# EAGLE design LoRa_RFM95_Shield (EAGLE 9.5.2)
CNAME: Arduino Uno LoRa Shield; CREVISION: 1.0.0
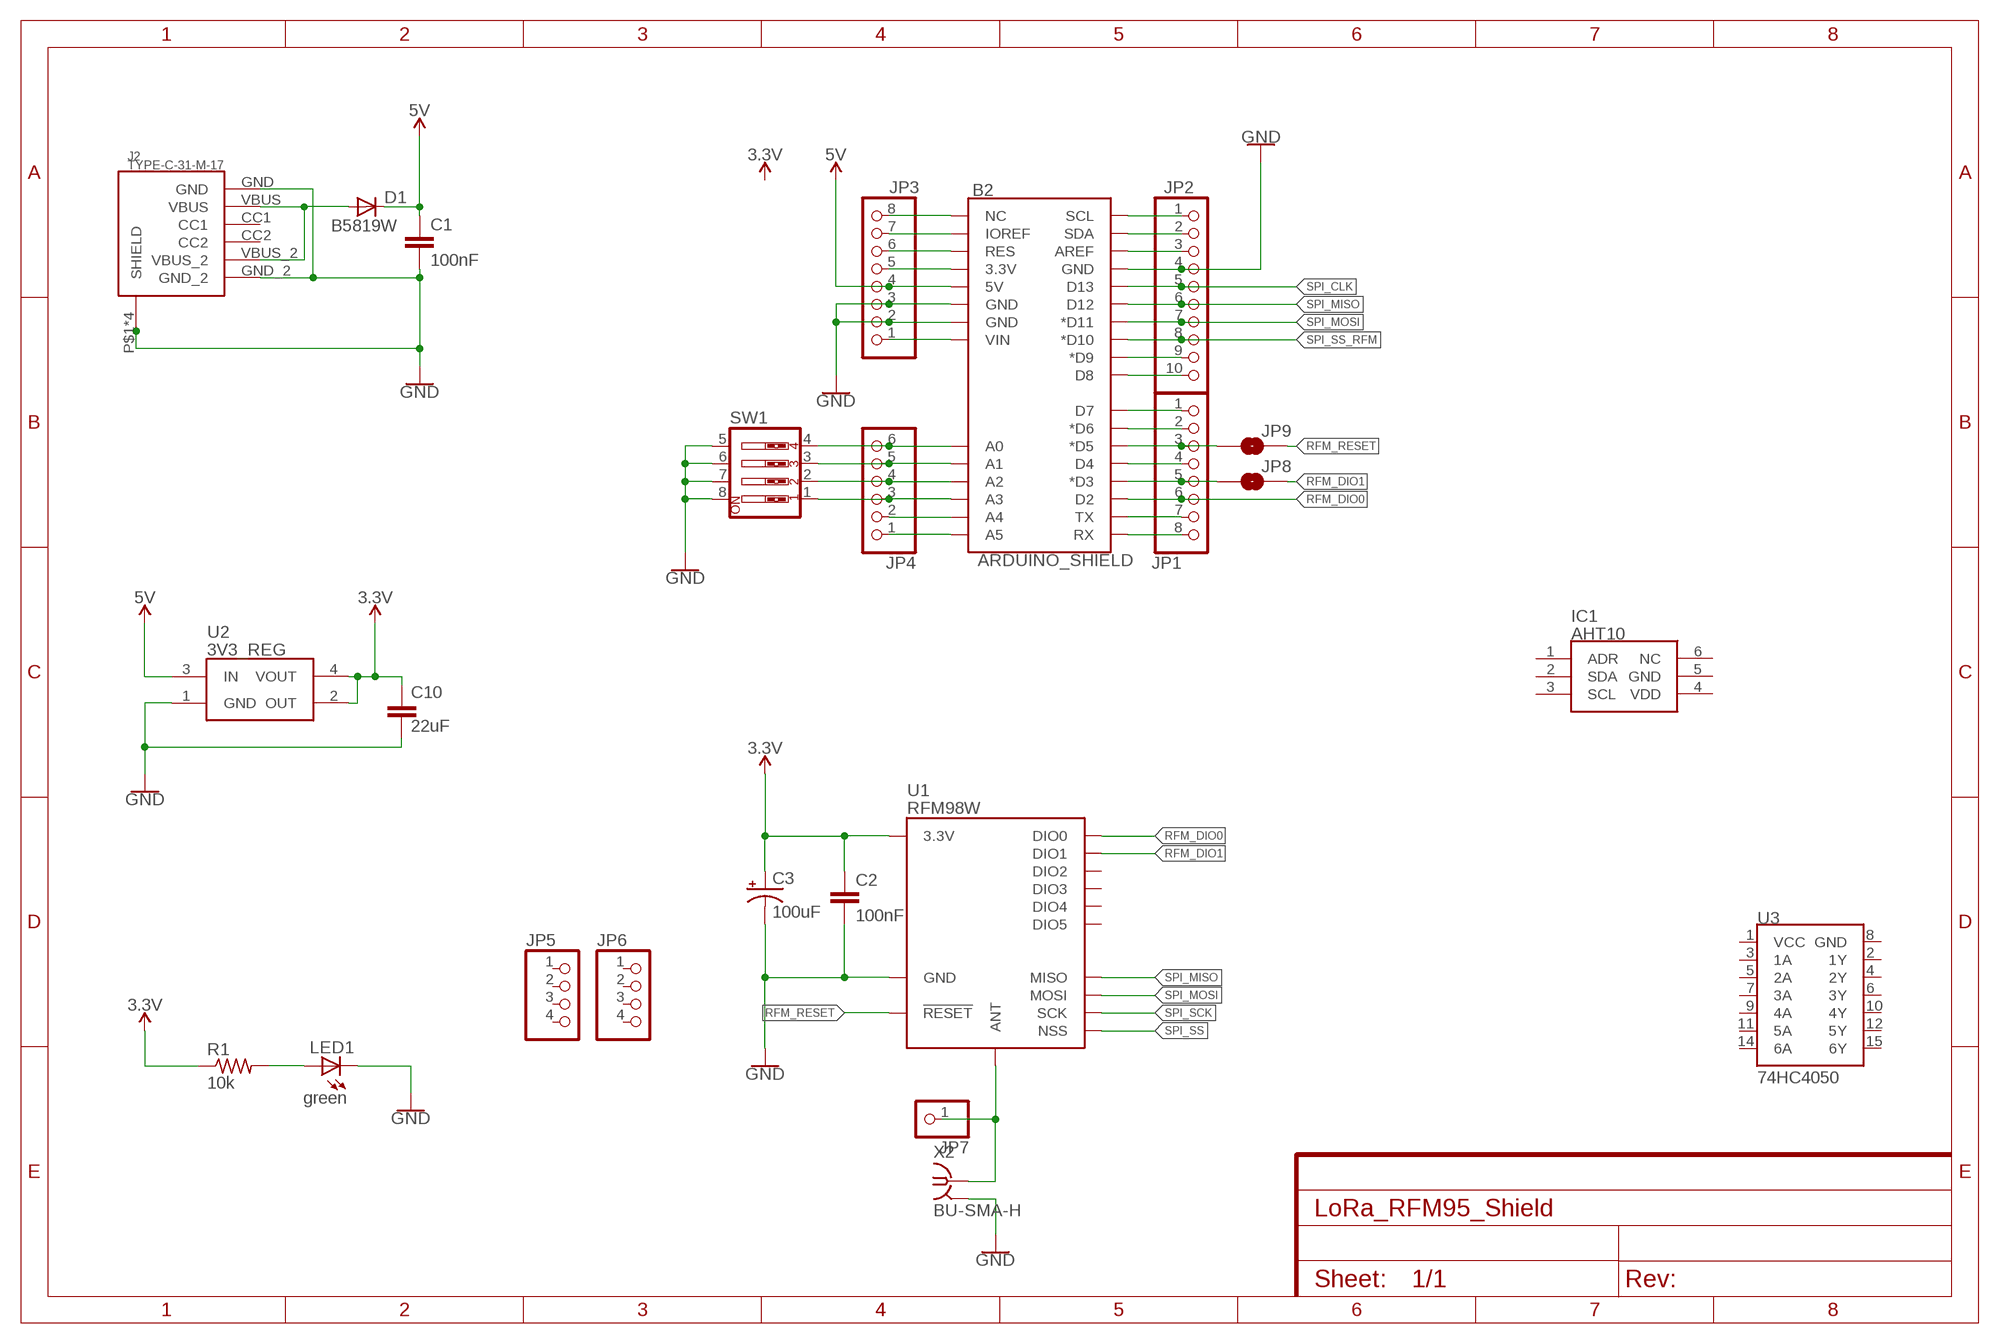
[diagram p0: schematic, sheet 1]

## Parts
B2  ARDUINO_SHIELD  ARDUINO_UNO_R3_SHIELDUNO_R3_SHIELD_NOLABELS_LOCK  [UNO_R3_SHIELD_NOLABELS_LOCK]
C1  100nF  C-EUC0603  [C0603]
C2  100nF  C-EUC0603  [C0603]
C3  100uF  CPOL-USSMCB  [SMC_B]
C10  22uF  C-EUC0805  [C0805]
D1  B5819W  DIODE-SOD-123  [SOD-123]
IC1  AHT10  [AHT10]
J2  TYPE-C-31-M-17  [TYPE-C-31-M-17]
JP1  PINHD-1X8/OCT  [1X08/OCT]
JP2  PINHD-1X10/OCT  [1X10/OCT]
JP3  PINHD-1X8/OCT  [1X08/OCT]
JP4  PINHD-1X6/OCT  [1X06/OCT]
JP5  PINHD-1X4/OCT  [1X04/OCT]
JP6  PINHD-1X4/OCT  [1X04/OCT]
JP7  PINHD-1X1/OCT  [1X01/OCT]
JP8  JUMPER-SMT_2_NO_SILK  [SMT-JUMPER_2_NO_SILK]
JP9  JUMPER-SMT_2_NO_SILK  [SMT-JUMPER_2_NO_SILK]
LED1  green  LEDCHIP-LED0603  [CHIP-LED0603]
R1  10k  R-US_R0603  [R0603]
SW1  SW_DIP-4  [EDG-04]
U1  RFM98W  RFM95W  [RFM95/96/97/98W]
U2  3V3_REG  AZ1117H-5.0TRE1  [SOT230P700X170-4N]
U3  74HC4050  HEX_CONVERTER  [SO16]
X2  BU-SMA-H  [BU-SMA-H]

## Nets
3.3V [power]: C2.1 C3.+ C10.2 R1.1 U1.3.3V U2.2(OUT) U2.4(VOUT)
5V [power]: B2.5V C1.1 D1.C JP3.4 U2.3(IN)
GND [power]: B2.GND@0(GND) B2.GND@1(GND) B2.GND@2(GND) C1.2 C2.2 C3.- C10.1 J2.GND J2.GND_2 J2.P$1(SHIELD) J2.P$2(SHIELD) J2.P$3(SHIELD) J2.P$4(SHIELD) JP2.4 JP3.2 JP3.3 LED1.C SW1.5 SW1.6 SW1.7 SW1.8 U1.GND@1(GND) U1.GND@2(GND) U1.GND@3(GND) U2.1(GND) X2.2 X2.3 X2.4 X2.5
N$1 [power]: D1.A J2.VBUS J2.VBUS_2
N$2 [RF]: JP7.1 U1.ANT X2.1
N$3: B2.SCL JP2.1
N$4: LED1.A R1.2
N$5: B2.SDA JP2.2
N$6: B2.AREF JP2.3
N$7: B2.VIN JP3.1
N$9: B2.D3(*D3) JP1.5 JP8.1
N$10: B2.D4 JP1.4
N$11: B2.D5(*D5) JP1.3 JP9.1
N$12: B2.D9(*D9) JP2.9
N$13: B2.D8 JP2.10
N$14: B2.D7 JP1.1
N$15: B2.D6(*D6) JP1.2
N$20: B2.TX JP1.7
N$21: B2.RX JP1.8
N$23: B2.3.3V JP3.5
N$24: B2.RES JP3.6
N$25: B2.IOREF JP3.7
N$26: B2.NC JP3.8
N$27: B2.A0 JP4.6 SW1.4
N$28: B2.A1 JP4.5 SW1.3
N$29: B2.A2 JP4.4 SW1.2
N$30: B2.A3 JP4.3 SW1.1
N$31: B2.A4 JP4.2
N$32: B2.A5 JP4.1
RFM_DIO0: B2.D2 JP1.6 U1.DIO0
RFM_DIO1: JP8.2 U1.DIO1
RFM_RESET: JP9.2 U1.!RESET
SPI_CLK: B2.D13 JP2.5
SPI_MISO: B2.D12 JP2.6 U1.MISO
SPI_MOSI: B2.D11(*D11) JP2.7 U1.MOSI
SPI_SCK [RF]: U1.SCK
SPI_SS: U1.NSS
SPI_SS_RFM: B2.D10(*D10) JP2.8
Unconnected: IC1.1(ADR) IC1.2(SDA) IC1.3(SCL) IC1.4(VDD) IC1.5(GND) IC1.6(NC) J2.CC1 J2.CC2 JP5.1 JP5.2 JP5.3 JP5.4 JP6.1 JP6.2 JP6.3 JP6.4 U1.DIO2 U1.DIO3 U1.DIO4 U1.DIO5 U3.1(VCC) U3.2(1Y) U3.3(1A) U3.4(2Y) U3.5(2A) U3.6(3Y) U3.7(3A) U3.8(GND) U3.9(4A) U3.10(4Y) U3.11(5A) U3.12(5Y) U3.14(6A) U3.15(6Y)

## Library data of the parts
B2 = angrypig7_Library:ARDUINO_UNO_R3_SHIELD: Arduino R3 Shield Footprint Shield form compatible with the Arduino Uno R3. SparkFun Products: MG2639 Cellular Shield <https://www.sparkfun.com/products/13120> MIDI Shield <https://www.sparkfun.com/products/12898> R3 Stackable Headers Kit <https://www.sparkfun.com/products/11417>
C1 C2 C10 = rcl:C-EU: CAPACITOR, European symbol; SPICEPREFIX: C
C3 = rcl:CPOL-US: POLARIZED CAPACITOR, American symbol; SPICEPREFIX: C
D1 = dp_devices:DIODE: Various Diode Packages
IC1 = SamacSys_Parts:AHT10: AHT10 Integrated temperature and humidity sensor Source: Datasheet <https://datasheet.lcsc.com/szlcsc/1901291508_Aosong-Guangzhou-Elec-AHT10_C368909.pdf>; DESCRIPTION: AHT10 Integrated temperature and humidity sensor; HEIGHT: 1.7mm; MANUFACTURER_NAME: Aosong (Guangzhou) Elec; MANUFACTURER_PART_NUMBER: AHT10
J2 = angrypig7_Library:TYPE-C-31-M-17
JP1 JP3 = pinhead_v2:PINHD-1X8: PIN HEADER
JP2 = pinhead_v2:PINHD-1X10: PIN HEADER
JP4 = pinhead_v2:PINHD-1X6: PIN HEADER
JP5 JP6 = pinhead_v2:PINHD-1X4: PIN HEADER
JP7 = pinhead_v2:PINHD-1X1: PIN HEADER
JP8 JP9 = SparkFun-Jumpers:JUMPER-SMT_2_NO: Normally open jumper This jumper has two pads in close proximity to each other. Apply solder to close the connection. Round pads are easier to solder for beginners, but are a lot larger. SparkFun Product that uses the round pads: SparkFun EL Sequencer <https://www.sparkfun.com/products/12781>
LED1 = adafruit:LED: LED OSRAM: - CHIPLED LG R971, LG N971, LY N971, LG Q971, LY Q971, LO R971, LY R971 LH N974, LH R974 LS Q976, LO Q976, LY Q976 LO Q996 - Hyper CHIPLED LW Q18S LB Q993, LB Q99A, LB R99A - SideLED LS A670, LO A670, LY A670, LG A670, LP A670 LB A673, LV A673, LT A673, LW A673 LH A674 LY A675 LS A676, LA A676, LO A676, LY A676, LW A676 LS A679, LY A679, LG A679 - Hyper Micro SIDELED® LS Y876, LA Y876, LO Y876, LY Y876 LT Y87S - SmartLED LW L88C, LW L88S LB L89C, LB L89S, LG L890 LS L89K, LO L89K, LY L89K LS L896, LA L896, LO L896, LY L896 - TOPLED LS T670, LO T670, LY T670, LG T670, LP T670 LSG T670, LSP T670, LSY T670, LOP T670, LYG T670 LG T671, LOG T671, LSG T671 LB T673, LV T673, LT T673, LW T673 LH T674 LS T676, LA T676, LO T676, LY T676, LB T676, LH T676, LSB T676, LW T676 LB T67C, LV T67C, LT T67C, LS T67K, LO T67K, LY T67K, LW E67C LS E67B, LA E67B, LO E67B, LY E67B, LB E67C, LV E67C, LT E67C LW T67C LS T679, LY T679, LG T679 LS T770, LO T770, LY T770, LG T770, LP T770 LB T773, LV T773, LT T773, LW T773 LH T774 LS E675, LA E675, LY E675, LS T675 LS T776, LA T776, LO T776, LY T776, LB T776 LHGB T686 LT T68C, LB T68C - Hyper Mini TOPLED® LB M676 - Mini TOPLED Santana® LG M470 LS M47K, LO M47K, LY M47K Source: http://www.osram.convergy.de/
R1 = rcl:R-US_: RESISTOR, American symbol; SPICEPREFIX: R
SW1 = special:SW_DIP-4: DIP SWITCH
U1 = SparkFun-RF:RFM95W: RFM95/96/97/98 The RFM95/96/97/98(W) transceivers feature the LoRaTM long range modem that provides ultra-long range spread spectrum communication and high interference immunity whilst minimising current consumption. These devices also support high performance (G)FSK modes for systems including WMBus, IEEE802.15.4g. The RFM95/96/97/98(W) deliver exceptional phase noise, selectivity, receiver linearity and IIP3 for significantly lower current consumption than competing devices Datasheet <http://www.hoperf.com/upload/rf/RFM95_96_97_98W.pdf>; PROD_ID: IC-13959
U2 = SamacSys_Parts:AZ1117H-5.0TRE1: 1A 5V LDO Linear Voltage Reg SOT-223 Diodes Inc AZ1117H-5.0TRE1, Single Linear Voltage Regulator, 1A 4.9 5.1 V, 1%, 3-Pin SOT-223 Source: Datasheet <https://componentsearchengine.com/Datasheets/1/AZ1117H-5.0TRE1.pdf>; DESCRIPTION: 1A 5V LDO Linear Voltage Reg SOT-223 Diodes Inc AZ1117H-5.0TRE1, Single Linear Voltage Regulator, 1A 4.9 5.1 V, 1%, 3-Pin SOT-223; HEIGHT: 1.7mm; MANUFACTURER_NAME: Diodes Inc.; MANUFACTURER_PART_NUMBER: AZ1117H-5.0TRE1; MOUSER_PART_NUMBER: 621-AZ1117H-5.0TRE1; MOUSER_PRICE-STOCK: https://www.mouser.com/Search/Refine.aspx?Keyword=621-AZ1117H-5.0TRE1
U3 = SparkFun-IC-Comms:HEX_CONVERTER: 74HC4050 Hex Buffer 74HC4050 Hex Buffer Level Shifter SMD SO016 SparkFun Products CAN-BUS Shield <https://www.sparkfun.com/products/13262> (DEV-13262) SparkFun MP3 Player Shield <https://www.sparkfun.com/products/12660> (DEV-12660) SparkFun microSD Shield <https://www.sparkfun.com/products/12761> (DEV-12761) SparkFun USB Host Shield <https://www.sparkfun.com/products/9947> (DEV-09947); PROD_ID: IC-09604
X2 = con-coax:BU-SMA-H: FEMALE SMA CONNECTOR Radiall; OC_FARNELL: unknown; OC_NEWARK: unknown

## Net classes
0 default: width 0.203 mm
1 power: width 0.508 mm
2 RF: width 1.524 mm

## Board
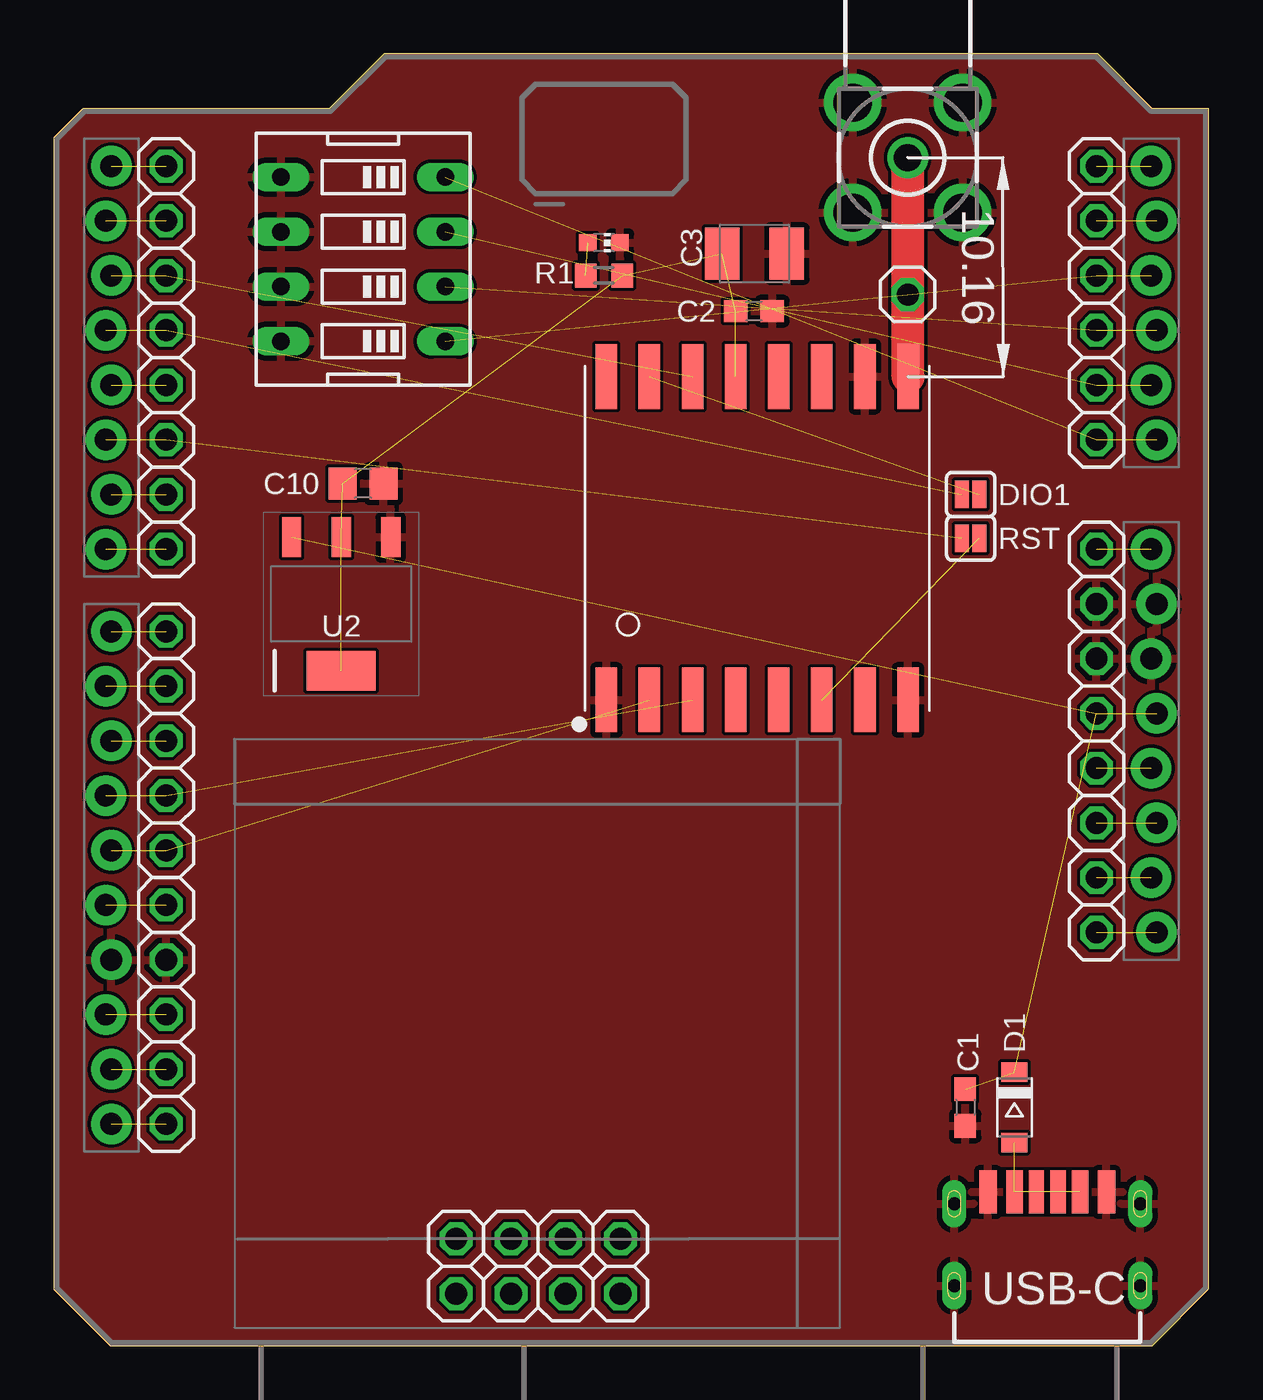
[diagram p1: board, top side]
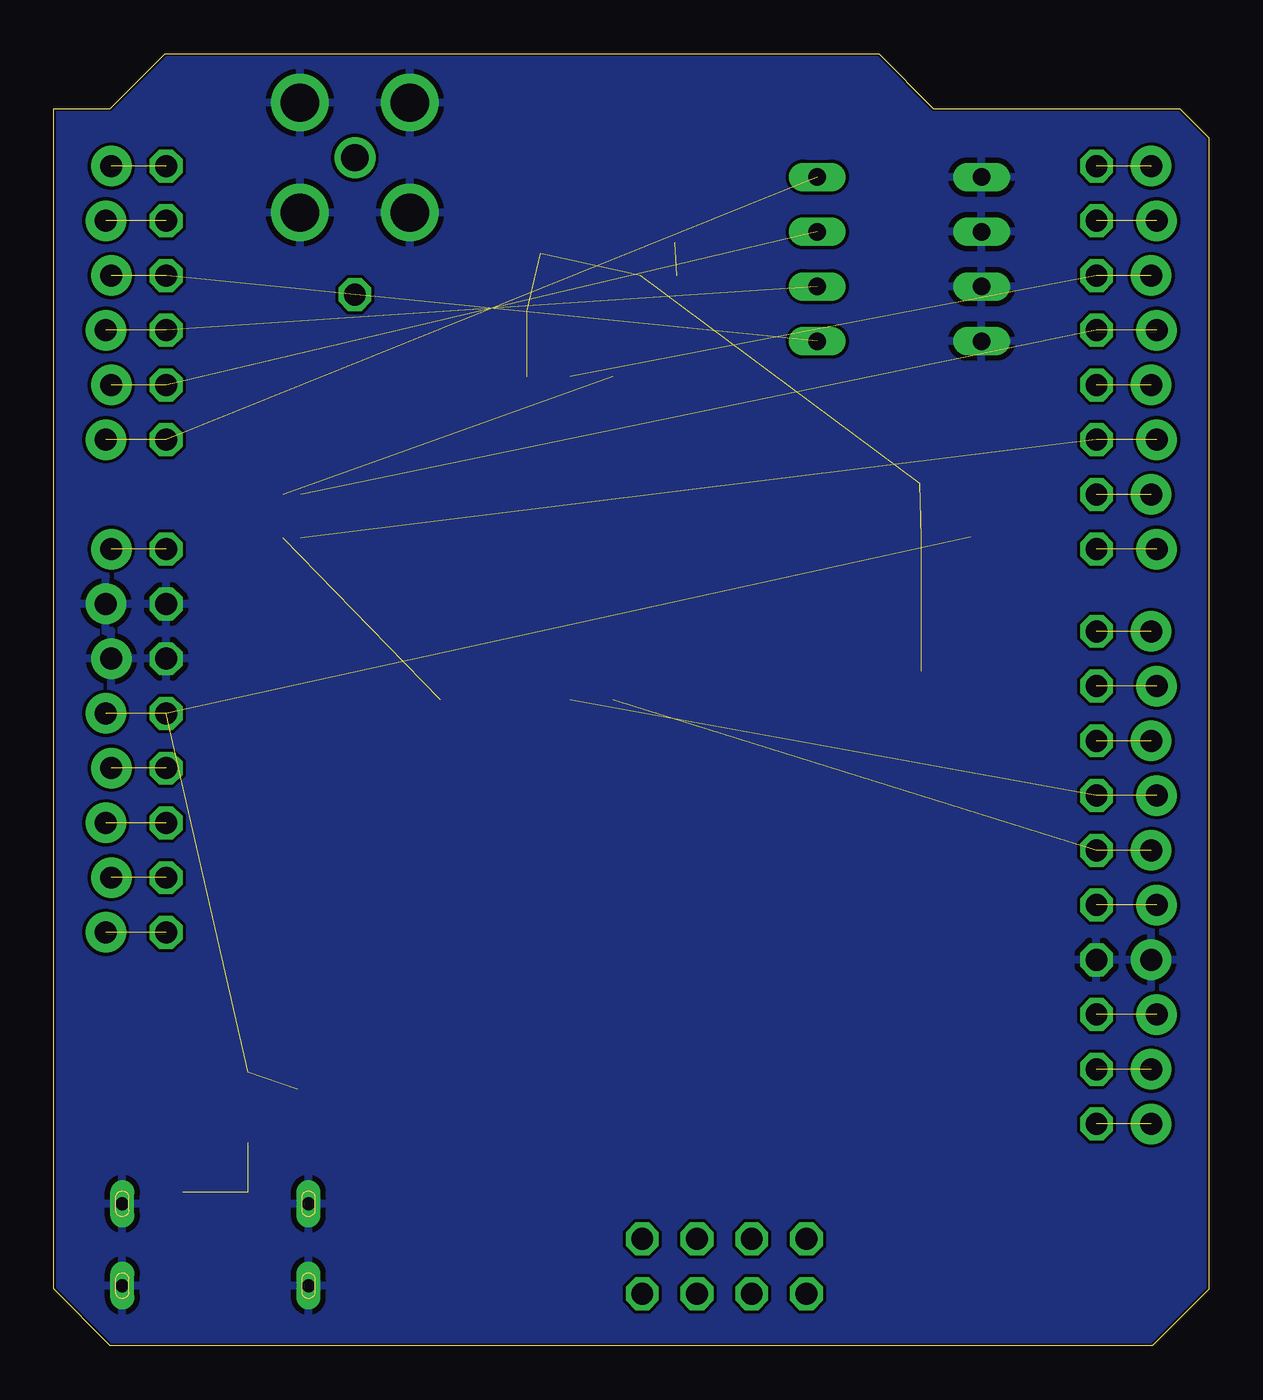
[diagram p2: board, bottom side, seen from below]

Size 53.59 x 59.94 mm. Coordinates in mm from the lower left corner, seen from the top.
Outline: 0,56.06 0,2.62 2.62,0 50.98,0 53.59,2.64 53.59,57.4 50.98,57.4 48.44,59.94 15.32,59.94 12.78,57.4 1.35,57.4 0,56.06
Copper layers (1*16): Top 0.035mm / dielectric 1.5mm / Bottom 0.035mm
Design rules "default *": minimum track width 6mil, minimum drill 0.35mm, track to track 6mil, track to pad 6mil, pad to pad 6mil, via to via 6mil, smd to smd 6mil, copper to edge 4mil, drill to drill 6mil, minimum pad ring 10mil, minimum via ring 8mil, stop-mask expansion 4mil, vias tented up to drill 0mil, thermal gap 10mil

### Footprints (pad centres in the part's own frame; a part is rotated, then mirrored left to right if it is on the bottom)
UNO_R3_SHIELD_NOLABELS_LOCK = drill 1.016 pad 1.88: 3.3V 24.13,-3.81; 5V 24.384,-1.27; A0 24.384,11.43; A1 24.13,13.97; A2 24.384,16.51; A3 24.13,19.05; A4 24.384,21.59; A5 24.13,24.13; AREF -24.384,-15.24; D2 -24.13,19.05; D3 -24.384,16.51; D4 -24.13,13.97; D5 -24.384,11.43; D6 -24.13,8.89; D7 -24.384,6.35; D8 -24.13,2.54; D9 -24.384,0; D10 -24.13,-2.54; D11 -24.384,-5.08; D12 -24.13,-7.62; D13 -24.384,-10.16; GND@0 24.13,1.27; GND@1 24.384,3.81; GND@2 -24.13,-12.7; IOREF 24.13,-8.89; NC 24.384,-11.43; RES 24.384,-6.35; RX -24.13,24.13; SCL -24.13,-20.32; SDA -24.13,-17.78; TX -24.384,21.59; VIN 24.13,6.35
C0603 = smd 1.1 x 1: 1 -0.85,0; 2 0.85,0
SMC_B = smd 1.6 x 2.4: + -1.5,0; - 1.5,0
C0805 = smd 1.3 x 1.5: 1 -0.95,0; 2 0.95,0
SOD-123 = smd 0.91 x 1.22: A 1.635,0; C -1.635,0
AHT10 = smd 1.27 x 1: 1 -1.6,1.27; 2 -1.6,0; 3 -1.6,-1.27; 4 1.6,-1.27; 5 1.6,0; 6 1.6,1.27
TYPE-C-31-M-17 = smd 0.7 x 2: CC1 -0.5,0.4; CC2 0.5,0.4 | smd 0.8 x 2: GND -2.75,0.4; GND_2 2.75,0.4 | drill 0.6 pad 1.1 long: P$1 4.32,-3.95; P$2 4.32,-0.15; P$3 -4.32,-0.15; P$4 -4.32,-3.95 | smd 0.76 x 2: VBUS -1.52,0.4; VBUS_2 1.52,0.4
1X08/OCT = drill 1.016 octagon: 1 -8.89,0; 2 -6.35,0; 3 -3.81,0; 4 -1.27,0; 5 1.27,0; 6 3.81,0; 7 6.35,0; 8 8.89,0
1X10/OCT = drill 1.016 octagon: 1 -11.43,0; 2 -8.89,0; 3 -6.35,0; 4 -3.81,0; 5 -1.27,0; 6 1.27,0; 7 3.81,0; 8 6.35,0; 9 8.89,0; 10 11.43,0
1X06/OCT = drill 1.016 octagon: 1 -6.35,0; 2 -3.81,0; 3 -1.27,0; 4 1.27,0; 5 3.81,0; 6 6.35,0
1X04/OCT = drill 1.016 octagon: 1 -3.81,0; 2 -1.27,0; 3 1.27,0; 4 3.81,0
1X01/OCT = drill 1.016 octagon: 1 0,0
SMT-JUMPER_2_NO_SILK = smd 0.635 x 1.27: 1 -0.406,0; 2 0.406,0
CHIP-LED0603 = smd 0.8 x 0.8: A 0,-0.75; C 0,0.75
R0603 = smd 1 x 1.1: 1 -0.85,0; 2 0.85,0
EDG-04 = drill 0.813 long: 1 -3.81,-3.81; 2 -1.27,-3.81; 3 1.27,-3.81; 4 3.81,-3.81; 5 3.81,3.81; 6 1.27,3.81; 7 -1.27,3.81; 8 -3.81,3.81
RFM95/96/97/98W = smd 3 x 1: 3.3V 7.5,1; !RESET -7.5,-3; ANT 7.5,-7; DIO0 7.5,3; DIO1 7.5,5; DIO2 7.5,7; DIO3 7.5,-3; DIO4 7.5,-1; DIO5 -7.5,-5; GND@1 -7.5,7; GND@2 -7.5,-7; GND@3 7.5,-5; MISO -7.5,5; MOSI -7.5,3; NSS -7.5,-1; SCK -7.5,1
SOT230P700X170-4N = smd 1.85 x 0.9: 1 3.1,-2.3; 2 3.1,0; 3 3.1,2.3 | smd 1.85 x 3.2: 4 -3.1,0
SO16 = smd 0.6 x 1.2: 1 -4.445,-2.8; 2 -3.175,-2.8; 3 -1.905,-2.8; 4 -0.635,-2.8; 5 0.635,-2.8; 6 1.905,-2.8; 7 3.175,-2.8; 8 4.445,-2.8; 9 4.445,2.8; 10 3.175,2.8; 11 1.905,2.8; 12 0.635,2.8; 13 -0.635,2.8; 14 -1.905,2.8; 15 -3.175,2.8; 16 -4.445,2.8
BU-SMA-H = drill 1.27: 1 0,0 | drill 1.778: 2 -2.55,2.55; 3 2.55,2.55; 4 2.55,-2.55; 5 -2.55,-2.55

### Placement (x,y rotation side)
B2  26.8,30.61 0 top
C1  42.29,11.05 270 top
C2  32.49,48.01 0 top
C3  32.51,50.67 0 top
C10  14.35,40.01 180 top
D1  44.58,11.05 270 top
IC1  -9.78,-11.3 0 top  (outside the outline)
J2  46.1,6.73 0 top
JP1  5.21,45.85 90 top
JP2  5.21,21.72 90 top
JP3  48.39,28.07 270 top
JP4  48.39,48.39 270 top
JP5  22.48,2.41 180 top
JP6  22.48,4.95 180 top
JP7  39.62,48.78 0 top
JP8  42.55,39.5 0 top
JP9  42.55,37.47 0 top
LED1  25.53,51.18 270 top
R1  25.53,49.66 180 top
SW1  14.35,50.42 90 top
U1  32.64,37.47 90 top
U2  13.34,34.42 90 top
U3  72.26,35.31 0 top  (outside the outline)
X2  39.62,55.13 90 top

### Tracks (layer width: path | path; a pad name or v marks a point on that pad's centre or on a via)
3.3V  (6 unrouted)
5V  (4 unrouted)
GND
  pour Top: -6.22,-4.95 59.82,-4.95 59.82,66.17 -6.22,66.17
  pour Bottom: -6.22,66.17 -6.22,-4.95 59.82,-4.95 59.82,66.17
N$1  (2 unrouted)
N$2
  Top 1.524: U1.ANT 39.64,48.76 JP7.1 X2.1
N$3  (1 unrouted)
N$4  (1 unrouted)
N$5  (1 unrouted)
N$6  (1 unrouted)
N$7  (1 unrouted)
N$9  (2 unrouted)
N$10  (1 unrouted)
N$11  (2 unrouted)
N$12  (1 unrouted)
N$13  (1 unrouted)
N$14  (1 unrouted)
N$15  (1 unrouted)
N$20  (1 unrouted)
N$21  (1 unrouted)
N$23  (1 unrouted)
N$24  (1 unrouted)
N$25  (1 unrouted)
N$26  (1 unrouted)
N$27  (2 unrouted)
N$28  (2 unrouted)
N$29  (2 unrouted)
N$30  (2 unrouted)
N$31  (1 unrouted)
N$32  (1 unrouted)
RFM_DIO0  (2 unrouted)
RFM_DIO1  (1 unrouted)
RFM_RESET  (1 unrouted)
SPI_CLK  (1 unrouted)
SPI_MISO  (2 unrouted)
SPI_MOSI  (2 unrouted)
SPI_SS_RFM  (1 unrouted)

### Text on the board
tPlace: DIO1 | RST | USB-C